# EasyEDA Pro project Project.epro

# Schematic Schematic1
Board Name: Board1; Create Date: 2026-03-28; Page Name: P1; Project Name: usb_hub; Schematic Name: Schematic1; Update Date: 2026-04-05; Company: EasyEDA.com; Page Size: A4; Version: V1.0
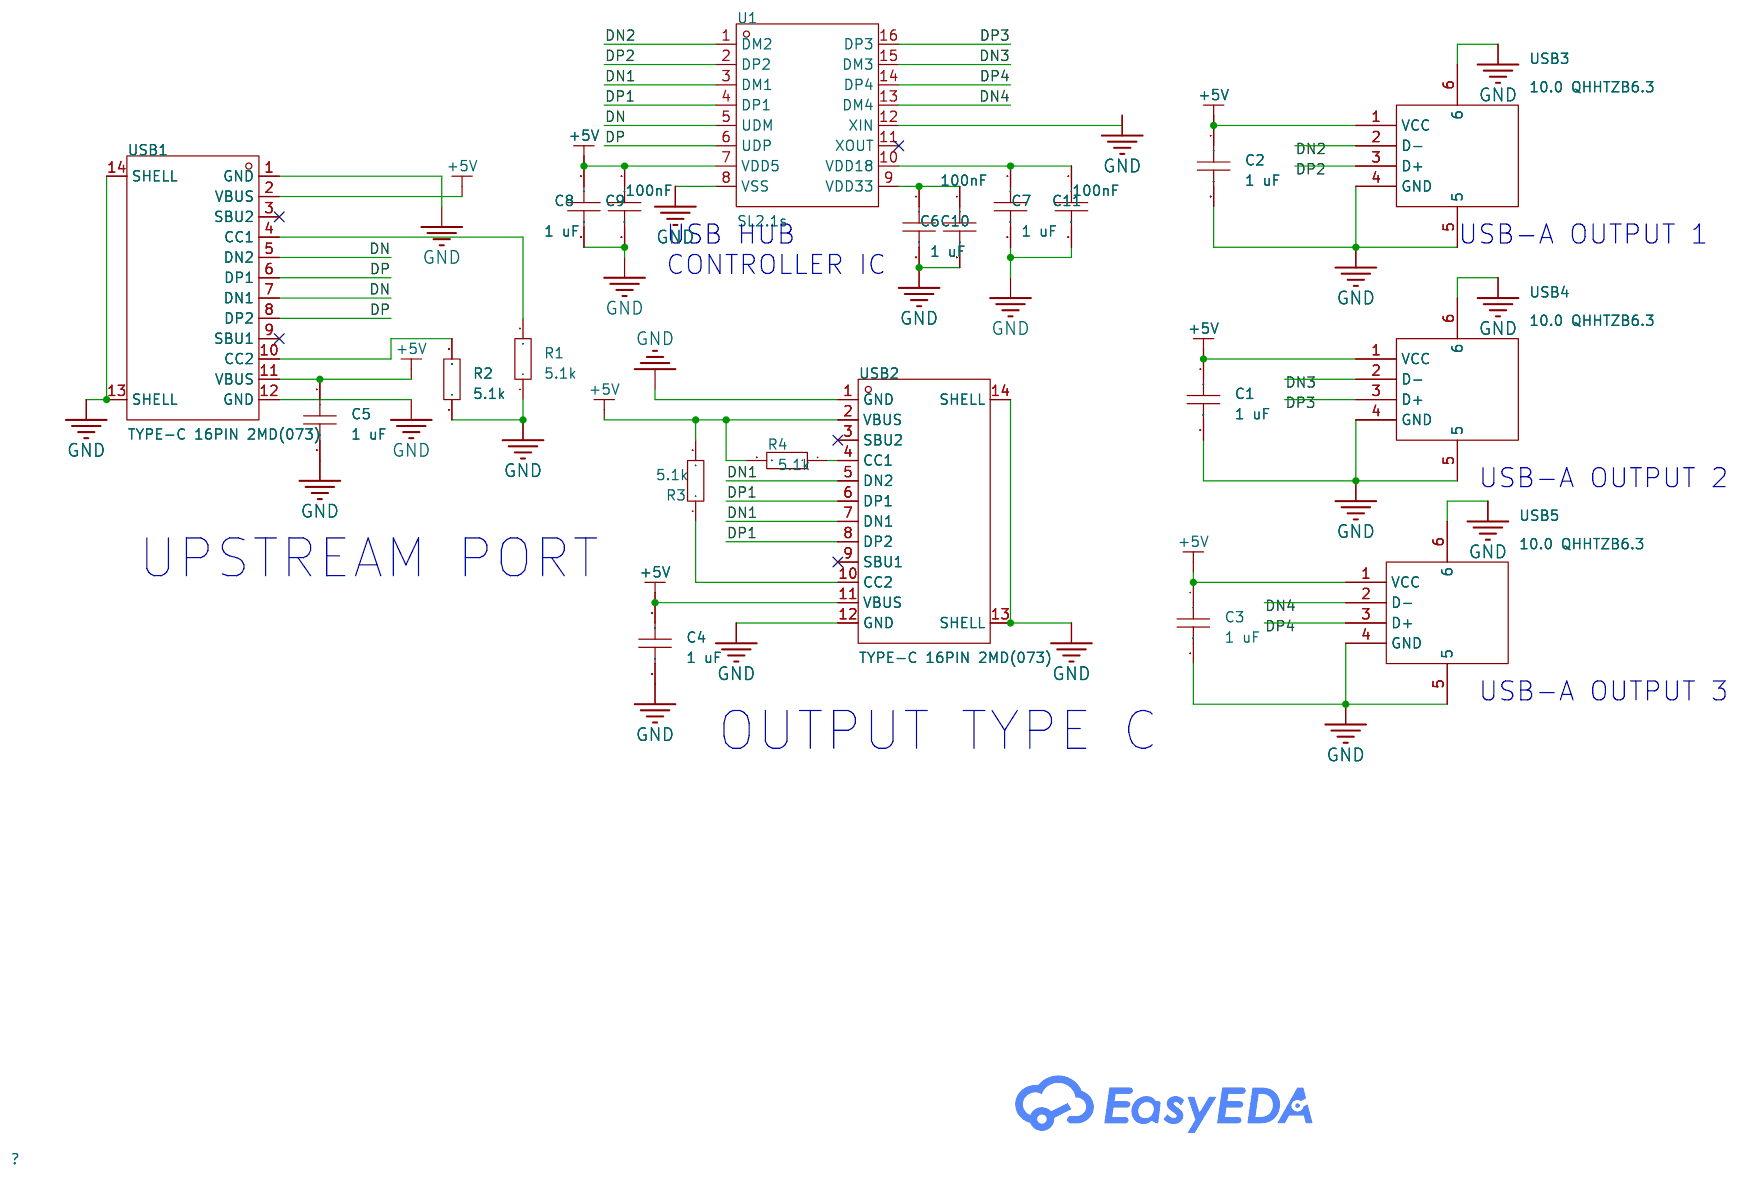
[diagram p0: schematic sheet]

## Parts
C1  1 uF  [C0603]
C2  1 uF  [C0603]
C3  1 uF  [C0603]
C4  1 uF  [C0603]
C5  1 uF  [C0603]
C6  1 uF  [C0603]
C7  1 uF  [C0603]
C8  1 uF  [C0603]
C9  100nF  [C0603]
C10  100nF  [C0603]
C11  100nF  [C0603]
R1  5.1k  [R0603]
R2  5.1k  [R0603]
R3  5.1k  [R0603]
R4  5.1k  [R0603]
U1  SL2.1s  [SSOP-16_L4.6-W2.6-P0.53-LS4.0-BL]
USB1  TYPE-C 16PIN 2MD(073)  [USB-C-SMD_TYPE-C-6PIN-2MD-073]
USB2  TYPE-C 16PIN 2MD(073)  [USB-C-SMD_TYPE-C-6PIN-2MD-073]
USB3  10.0 QHHTZB6.3  [USB-A-TH_10.0QHHTZB6.3]
USB4  10.0 QHHTZB6.3  [USB-A-TH_10.0QHHTZB6.3]
USB5  10.0 QHHTZB6.3  [USB-A-TH_10.0QHHTZB6.3]

## Library data of the parts
C1-C11 = CAP_0603: Supplier Footprint: 0603
R1-R4 = Res_0603: Supplier Footprint: 0603
U1 = SL2.1s: type:Hub USB Protocol:USB 2.0 Voltage - Supply:4V~5.25V Voltage - Supply:4V~5.25V Operating Temperature:0℃~+70℃ Operating Temperature:0℃~+70℃ Current - Supply:120mA Quiescent Supply Current:2.5mA Number of Channels:4; LCSC Part Name: USB2.0 HUB控制器集成电路; Supplier Part: C2684433; Manufacturer: CoreChips(和芯润德); Supplier Footprint: SSOP-16; JLCPCB Part Class: Extended Part; Datasheet: https://item.szlcsc.com/datasheet/SL2.1s/2782346.html; Supplier: LCSC; type: Hub; USB Protocol: USB 2.0; Voltage - Supply: 4V~5.25V; Operating Temperature: 0℃~+70℃; Current - Supply: 120mA; Quiescent Supply Current: 2.5mA; Number of Channels: 4
USB1 USB2 = TYPE-C 16PIN 2MD(073): Connector Type:Type-C Protocol Standard:- Gender:Female Mounting Type:Surface Mount, Right Angle Number of Contacts:16P Number of Ports:1 Current Rating-Power:3A Voltage Rating:5V Connect-Disconnect Life:10,000 Cycles Supplementary Features:- Center Heigh; LCSC Part Name: Type-C 母 卧贴; Supplier Part: C2765186; Manufacturer: SHOU HAN(首韩); Supplier Footprint: SMD; JLCPCB Part Class: Extended Part; Datasheet: https://item.szlcsc.com/datasheet/TYPE-C%252016PIN%25202MD(073)/2901843.html; Supplier: LCSC; Connector Type: Type-C; Gender: Female; Mounting Type: Surface Mount, Right Angle; Number of Contacts: 16P; Number of Ports: 1; Current Rating-Power: 3A; Voltage Rating: 5V; Connect-Disconnect Life: 10,000 Cycles; Detection color: Black; Operating Temperature: -25℃~+85℃
USB3-USB5 = 10.0 QHHTZB6.3: Connector Type:Type-A Protocol Standard:USB 2.0 Gender:Female Mounting Type:Surface Mount, Right Angle Number of Contacts:4P Number of Ports:1 Current Rating-Power:1.5A Voltage Rating:30V Connect-Disconnect Life:5,000 times Supplementary Features:- Center; LCSC Part Name: 壳长10.0mm; Supplier Part: C668591; Manufacturer: SHOU HAN(首韩); Supplier Footprint: SMD; JLCPCB Part Class: Extended Part; Datasheet: https://item.szlcsc.com/datasheet/10.0%2520QHHTZB6.3/698534.html; Supplier: LCSC; Connector Type: Type-A; Protocol Standard: USB 2.0; Gender: Female; Mounting Type: Surface Mount, Right Angle; Number of Contacts: 4P; Number of Ports: 1; Current Rating-Power: 1.5A; Voltage Rating: 30V; Connect-Disconnect Life: 5,000 times; Length: 10mm; Detection color: Black; Operating Temperature: -25℃~+85℃

## Nets
+5V: C1.1 C2.1 C3.1 C4.1 C5.1 C8.1 C9.1 R3.2 R4.2 U1.7(VDD5) USB1.2(VBUS) USB1.11(VBUS) USB2.2(VBUS) USB2.11(VBUS) USB3.1(VCC) USB4.1(VCC) USB5.1(VCC)
GND: C1.2 C2.2 C3.2 C4.2 C5.2 C6.2 C7.2 C8.2 C9.2 C10.2 C11.2 R1.1 R2.1 U1.8(VSS) U1.12(XIN) USB1.1(GND) USB1.12(GND) USB1.13(SHELL) USB1.14(SHELL) USB2.1(GND) USB2.12(GND) USB2.13(SHELL) USB2.14(SHELL) USB3.4(GND) USB3.5 USB3.6 USB4.4(GND) USB4.5 USB4.6 USB5.4(GND) USB5.5 USB5.6
DN: U1.5(UDM) USB1.5(DN2) USB1.7(DN1)
DN1: U1.3(DM1) USB2.5(DN2) USB2.7(DN1)
DN2: U1.1(DM2) USB3.2(D-)
DN3: U1.15(DM3) USB4.2(D-)
DN4: U1.13(DM4) USB5.2(D-)
DP: U1.6(UDP) USB1.6(DP1) USB1.8(DP2)
DP1: U1.4(DP1) USB2.6(DP1) USB2.8(DP2)
DP2: U1.2(DP2) USB3.3(D+)
DP3: U1.16(DP3) USB4.3(D+)
DP4: U1.14(DP4) USB5.3(D+)
$1N843: R2.2 USB1.10(CC2)
$1N849: R1.2 USB1.4(CC1)
$1N1535: R3.1 USB2.10(CC2)
$1N1585: R4.1 USB2.4(CC1)
$1N1869: C6.1 C10.1 U1.9(VDD33)
$1N1897: C7.1 C11.1 U1.10(VDD18)

Not connected (* = marked no-connect by the designer): U1 11(XOUT)*; USB1 3(SBU2)* 9(SBU1)*; USB2 3(SBU2)* 9(SBU1)*

## Notes on the sheet
- USB-A OUTPUT 1
- USB HUB
  CONTROLLER IC
- USB-A OUTPUT 2
- UPSTREAM PORT
- USB-A OUTPUT 3
- OUTPUT TYPE C

# Board PCB1
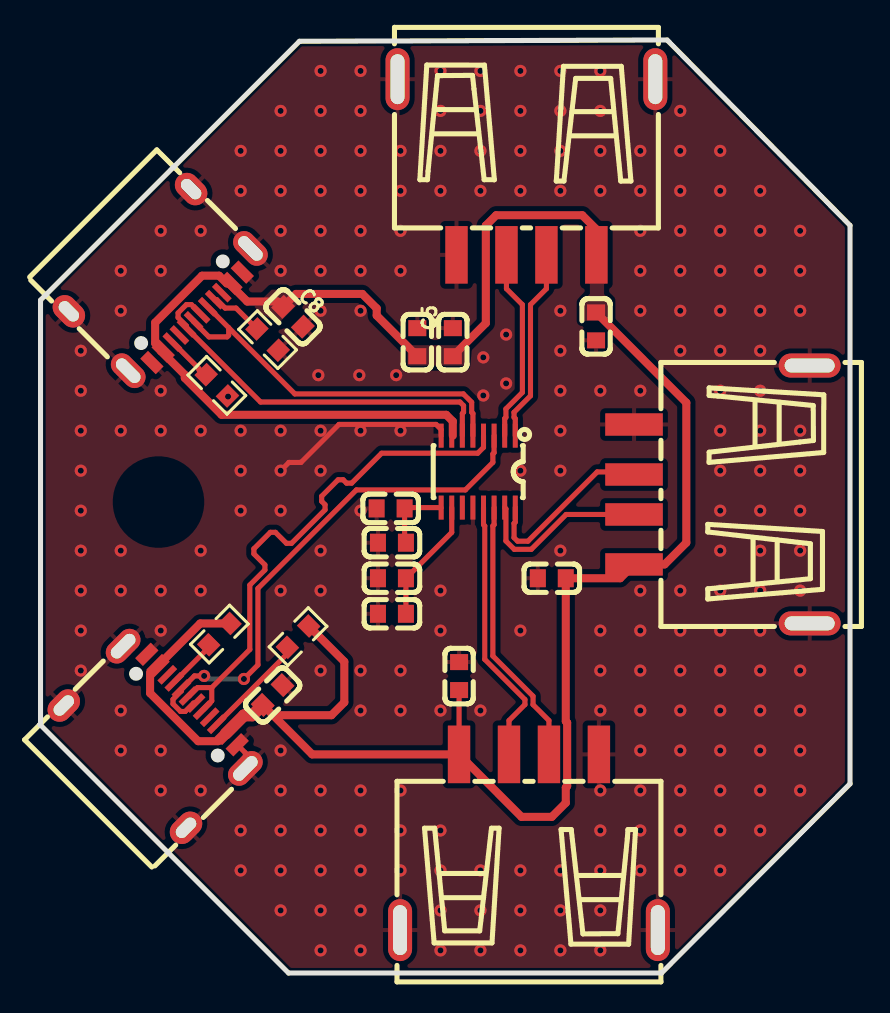
[diagram p1: board, top side]
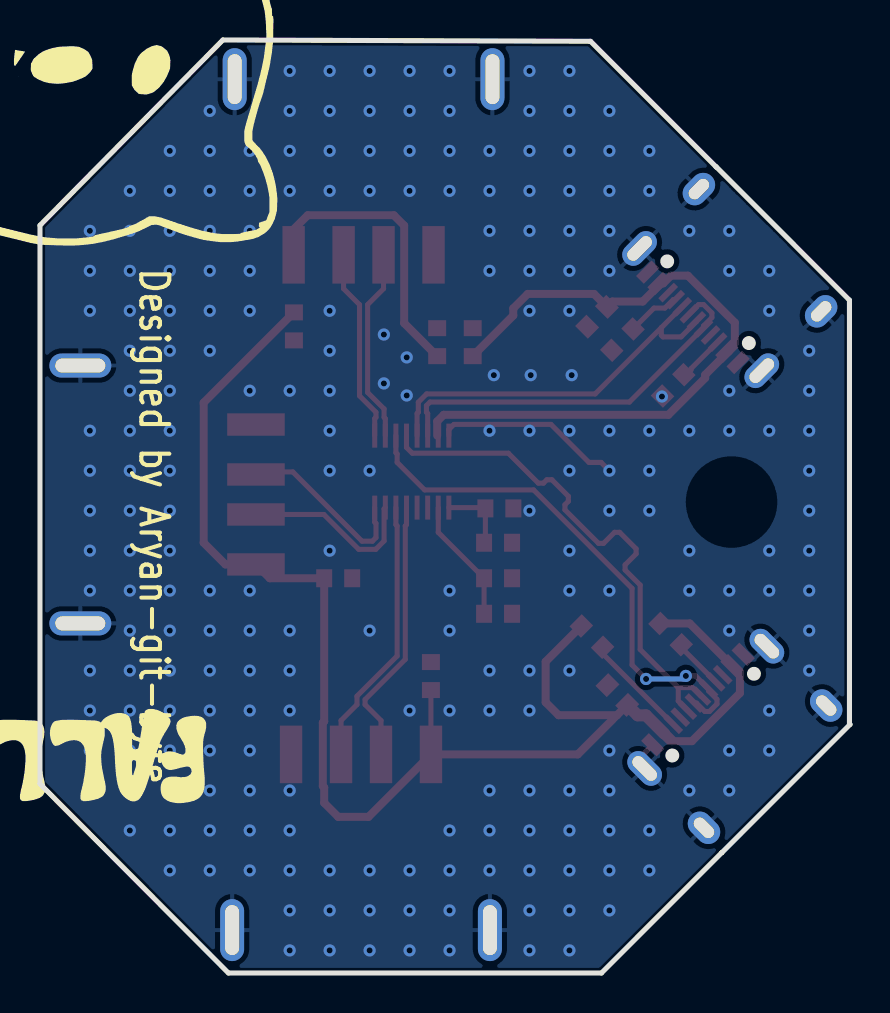
[diagram p2: board, bottom side, seen from below]

Outline 40.54 x 46.68 mm; copper layers: Top Layer, Bottom Layer. Coordinates in mm from the lower left corner of the outline.
Outline path: 0,12.44 6.41,6.02 6.42,6.02 12.44,0 31.11,0 40.54,9.46 40.54,37.4 31.38,46.68 12.99,46.61 6.7,40.33 6.69,40.33 0.03,33.66 0.03,12.47 0,12.44
Stack: Top Layer 0.035mm / Dielectric1 1.51mm FR4 er 4.5 / Bottom Layer 0.035mm

## Design rules (mm)
net DP2: DP5
net DN2: DP5
net DP1: DP2
net DN1: DP2
net DP: DP3
net DN: DP3
net DN4: DP1
net DP4: DP1
net DN3: DP4
net DP3: DP4
template: JLCPCB Capability(Two Layers Board)
spacing copperThickness1oz (default): track to track 0.102, other pairs 0.152 to 0.3
spacing copperThickness2oz: track to track 0.203, other pairs 0.152 to 0.3
track width copperThickness1oz (default): min 0.127, default 0.254, max 2.54
track width copperThickness2oz: min 0.203, default 0.254, max 2.54
differential pair differentialPair (default): width min 0.127, default 0.254, max 2.54; gap min 0.152, default 0.152
via viaSize (default): diameter min 0.5, default 0.61, max 10; hole min 0.3, default 0.305, max 6.3

## Placement (name value [footprint] x y rotation side)
C1  1 uF  [C0603]  20.97 14.86 90 top
C2  1 uF  [C0603]  27.83 32.35 270 top
C3  1 uF  [C0603]  25.62 19.75 180 top
C4  1 uF  [C0603]  11.65 13.91 45 top
C5  1 uF  [C0603]  18.88 31.56 90 top
C6  1 uF  [C0603]  17.55 23.24 180 top
C7  1 uF  [C0603]  17.61 19.75 180 top
C8  1 uF  [C0603]  12.66 32.83 315 top
C9  100nF  [C0603]  20.66 31.56 90 top
C10  100nF  [C0603]  17.61 21.53 180 top
C11  100nF  [C0603]  17.61 17.97 180 top
R1  5.1k  [R0603]  11.39 31.69 135 top
R2  5.1k  [R0603]  8.85 29.4 135 top
R3  5.1k  [R0603]  12.91 16.83 45 top
R4  5.1k  [R0603]  8.98 16.96 45 top
U1  SL2.1s  [SSOP-16_L4.6-W2.6-P0.53-LS4.0-BL]  21.93 25.08 180 top
USB1  TYPE-C 16PIN 2MD(073)  [USB-C-SMD_TYPE-C-6PIN-2MD-073]  6.18 34.48 225 top
USB2  TYPE-C 16PIN 2MD(073)  [USB-C-SMD_TYPE-C-6PIN-2MD-073]  5.93 12 315 top
USB3  10.0 QHHTZB6.3  [USB-A-TH_10.0QHHTZB6.3]  24.34 40.32 180 top
USB4  10.0 QHHTZB6.3  [USB-A-TH_10.0QHHTZB6.3]  34.12 23.94 90 top
USB5  10.0 QHHTZB6.3  [USB-A-TH_10.0QHHTZB6.3]  24.47 6.54 0 top

## Footprints (pads in the part's own frame, mm; a bottom-side part is the same pattern mirrored in y, then rotated)
C0603
  rect 0.8x0.9 smd: 1(-0.7,0) 2(0.7,0)
R0603
  rect 0.806x0.864 smd: 1(-0.753,0) 2(0.753,0)
SSOP-16_L4.6-W2.6-P0.53-LS4.0-BL
  rect 0.25x1.2 smd: 1(-1.855,-1.8) 2(-1.325,-1.8) 3(-0.795,-1.8) 4(-0.265,-1.8) 5(0.265,-1.8) 6(0.795,-1.8) 7(1.325,-1.8) 8(1.855,-1.8) 9(1.855,1.8) 10(1.325,1.8) 11(0.795,1.8) 12(0.265,1.8) 13(-0.265,1.8) 14(-0.795,1.8) 15(-1.325,1.8) 16(-1.855,1.8)
USB-A-TH_10.0QHHTZB6.3
  rect 1.12x2.88 smd: 1(-3.5,4.395) 2(-1,4.395) 3(1,4.395) 4(3.5,4.395)
  oval 1.2x3.1 hole 0.7x2.5: 5(-6.45,-4.395) 6(6.45,-4.395)
USB-C-SMD_TYPE-C-6PIN-2MD-073
  rect 0.55x1.1 smd: 1(-3.2,2.375) 2(-2.4,2.375) 11(2.4,2.375) 12(3.2,2.375)
  rect 0.3x1.1 smd: 3(-1.75,2.375) 4(-1.25,2.375) 5(-0.75,2.375) 6(-0.25,2.375) 7(0.25,2.375) 8(0.75,2.375) 9(1.25,2.375) 10(1.75,2.375)
  oval 1.1x2 hole 0.6x1.5: 13(-4.325,1.825) 14(4.325,1.825)
  oval 1.2x1.8 hole 0.6x1.2: 13(-4.325,-2.375) 14(4.325,-2.375)

## Nets
As in the schematic.

Pads without a net: U1 11; USB1 3 9; USB2 3 9

## Via types
v1: diameter 0.61, hole 0.305, Top Layer to Bottom Layer, 234 vias

## Routing (per net, layer and track width the routed paths; a pad name or vN(x,y) marks a point on that pad's centre or on a via; arc(x,y) is an arc through that point)
+5V: length 123.3
  Top Layer w0.254: USB5.1 20.97,10.94 C1.1
  Top Layer w0.4: 9.31,11.99 8.92,11.6 7.91,11.6 5.51,14 5.51,15.05 ; R4.2 8.02,17.49 USB2.2 ; 6.06,31.11 6.07,31.11 7.25,29.93 7.25,29.77 9.09,27.93 20.33,27.93 20.66,27.6 20.66,26.88 ; C5.1 16.85,32.89 16.85,33.25 16.13,33.97 12.81,33.97 12.17,33.33 11.9,33.59 10.38,33.59 9.56,34.41 USB1.2 9.35,34.5 8.96,34.89 8.11,34.89 5.77,32.54 5.77,31.51 6.17,31.11 ; C2.1 32.35,28.54 32.35,21.53 31.26,20.44 USB4.1 29.04,19.75 C3.1 26.31,12.59 26.38,12.52 26.38,9.35 26.31,9.28 26.31,8.51 25.62,7.81 24.1,7.81 USB5.1 13.63,10.94 11.67,12.9 ; 11.67,12.9 14.59,12.9 15.23,13.54 15.23,15.58 R3.2 ; 11.67,12.9 11.15,13.41 ; C9.1 22.31,32.51 22.31,37.4 22.83,37.91 27.14,37.91 27.84,37.21 USB3.1
  Top Layer w0.6: 11.15,13.41 10.63,12.89 10.21,12.89 9.31,11.99
GND: length 10.8
  Top Layer w0.254: USB2.14 10.28,11.01 USB2.12 ; U1.8 20.08,27.19 19.82,27.45 14.97,27.45 13.06,25.54 12.46,25.54 v1(12.04,25.13)
  vias: v1(2.04,31.13) v1(2.04,29.13) v1(2.04,27.13) v1(2.04,25.13) v1(2.04,23.13) v1(2.04,21.13) v1(2.04,19.13) v1(2.04,17.13) v1(2.04,15.13) v1(4.04,35.13) v1(4.04,33.13) v1(4.04,27.13) v1(4.04,21.13) v1(4.04,19.13) v1(4.04,13.13) v1(4.04,11.13) v1(6.04,37.13) v1(6.04,35.13) v1(6.04,29.13) v1(6.04,27.13) v1(6.04,19.13) v1(6.04,17.13) v1(6.04,11.13) v1(6.04,9.13) v1(8.04,37.13) v1(8.04,27.13) v1(8.04,21.13) v1(8.04,19.13) v1(8.04,9.13) v1(9.41,28.84) v1(10.04,41.13) v1(10.04,39.13) v1(10.04,27.13) v1(10.04,25.13) v1(10.04,23.13) v1(10.04,7.13) v1(10.04,5.13) v1(12.04,43.13) v1(12.04,41.13) v1(12.04,39.13) v1(12.04,37.13) v1(12.04,35.13) v1(12.04,27.13) v1(12.04,23.13) v1(12.04,19.13) v1(12.04,11.13) v1(12.04,9.13) v1(12.04,7.13) v1(12.04,5.13) v1(12.04,3.13) v1(13.93,29.91) v1(14.04,45.13) v1(14.04,43.13) v1(14.04,41.13) v1(14.04,39.13) v1(14.04,37.13) v1(14.04,35.13) v1(14.04,33.13) v1(14.04,27.13) v1(14.04,25.13) v1(14.04,21.13) v1(14.04,19.13) v1(14.04,15.13) v1(14.04,9.13) v1(14.04,7.13) v1(14.04,5.13) v1(14.04,3.13) v1(14.04,1.13) v1(16.04,45.13) v1(16.04,43.13) v1(16.04,41.13) v1(16.04,39.13) v1(16.04,37.13) v1(16.04,35.13) v1(16.04,33.13) v1(15.98,29.91) v1(16.04,27.13) v1(16.04,23.13) v1(16.04,15.13) v1(16.04,13.13) v1(16.04,9.13) v1(16.04,7.13) v1(16.04,5.13) v1(16.04,3.13) v1(16.04,1.13) v1(17.83,29.91) v1(18.04,41.13) v1(18.04,39.13) v1(18.04,37.13) v1(18.04,35.13) v1(18.04,27.13) v1(18.04,15.13) v1(18.04,13.13) v1(18.04,9.13) v1(18.04,7.13) v1(18.04,5.13) v1(20.04,45.13) v1(20.04,43.13) v1(20.04,41.13) v1(20.04,39.13) v1(20.04,19.13) v1(20.04,17.13) v1(20.04,13.13) v1(20.04,7.13) v1(20.04,5.13) v1(20.04,3.13) v1(20.04,1.13) v1(22.04,45.13) v1(22.04,43.13) v1(22.04,41.13) v1(22.04,39.13) v1(22.04,13.13) v1(22.04,5.13) v1(22.04,3.13) v1(22.04,1.13) v1(22.19,30.8) v1(22.19,28.89) v1(23.33,31.94) v1(23.33,29.5) v1(24.04,45.13) v1(24.04,43.13) v1(24.04,41.13) v1(24.04,39.13) v1(24.04,25.13) v1(24.04,17.13) v1(24.04,5.13) v1(24.04,3.13) v1(24.04,1.13) v1(26.04,45.13) v1(26.04,43.13) v1(26.04,41.13) v1(26.04,39.13) v1(26.04,33.13) v1(26.04,31.13) v1(26.04,29.13) v1(26.04,27.13) v1(26.04,25.13) v1(26.04,21.13) v1(26.04,5.13) v1(26.04,3.13) v1(26.04,1.13) v1(28.04,45.13) v1(28.04,43.13) v1(28.04,41.13) v1(28.04,39.13) v1(28.04,29.13) v1(28.04,17.13) v1(28.04,15.13) v1(28.04,13.13) v1(28.04,9.13) v1(28.04,7.13) v1(28.04,5.13) v1(28.04,3.13) v1(28.04,1.13) v1(30.04,41.13) v1(30.04,39.13) v1(30.04,37.13) v1(30.04,35.13) v1(30.04,33.13) v1(30.04,29.13) v1(30.04,19.13) v1(30.04,17.13) v1(30.04,15.13) v1(30.04,13.13) v1(30.04,11.13) v1(30.04,9.13) v1(30.04,7.13) v1(30.04,5.13) v1(32.04,43.13) v1(32.04,41.13) v1(32.04,39.13) v1(32.04,37.13) v1(32.04,35.13) v1(32.04,33.13) v1(32.04,31.13) v1(32.04,19.13) v1(32.04,17.13) v1(32.04,15.13) v1(32.04,13.13) v1(32.04,11.13) v1(32.04,9.13) v1(32.04,7.13) v1(32.04,5.13) v1(34.04,41.13) v1(34.04,39.13) v1(34.04,37.13) v1(34.04,35.13) v1(34.04,33.13) v1(34.04,31.13) v1(34.04,29.13) v1(34.04,27.13) v1(34.04,25.13) v1(34.04,23.13) v1(34.04,21.13) v1(34.04,19.13) v1(34.04,17.13) v1(34.04,15.13) v1(34.04,13.13) v1(34.04,11.13) v1(34.04,9.13) v1(34.04,7.13) v1(34.04,5.13) v1(36.04,39.13) v1(36.04,37.13) v1(36.04,35.13) v1(36.04,33.13) v1(36.04,31.13) v1(36.04,29.13) v1(36.04,27.13) v1(36.04,25.13) v1(36.04,23.13) v1(36.04,21.13) v1(36.04,19.13) v1(36.04,17.13) v1(36.04,15.13) v1(36.04,13.13) v1(36.04,11.13) v1(36.04,9.13) v1(36.04,7.13) v1(38.04,37.13) v1(38.04,35.13) v1(38.04,33.13) v1(38.04,27.13) v1(38.04,25.13) v1(38.04,23.13) v1(38.04,21.13) v1(38.04,19.13) v1(38.04,15.13) v1(38.04,13.13) v1(38.04,11.13) v1(38.04,9.13)
DN: length 19.4
  Top Layer w0.254: USB1.7 7.69,32.59 8.46,31.82 9.37,31.82 9.44,31.9 9.44,32.28 ; 9.44,32.28 USB1.5 ; 9.44,32.28 12.75,28.97 21.19,28.97 21.61,28.55 21.61,28.05 21.67,27.99 U1.5
DN1: length 26.4
  Top Layer w0.254: 7.79,13.51 7.69,13.51 7.27,13.09 7.03,13.09 6.66,13.46 6.66,13.69 7.08,14.11 USB2.5 7.73,14.86 v1(8.22,14.86) ; U1.3 22.73,26.03 22.66,25.97 22.66,25.55 21.29,24.17 15.84,24.17 10.91,19.24 10.91,15.41 v1(10.21,14.71)
  Bottom Layer w0.254: v1(10.21,14.71) 8.37,14.71 v1(8.22,14.86)
DN2: length 9.7
  Top Layer w0.254: U1.1 23.79,27.74 23.72,27.8 23.72,28.05 24.55,28.88 24.55,33.44 25.34,34.24 USB3.2
DN3: length 9
  Top Layer w0.254: U1.15 23.32,23.22 23.32,21.61 23.74,21.2 24.59,21.2 26.33,22.94 USB4.2
DN4: length 13.5
  Top Layer w0.254: USB5.2 23.47,12.63 24.27,13.43 24.27,13.68 22.26,15.69 22.26,22.37 22.2,22.43 U1.13
DP: length 19.4
  Top Layer w0.254: USB1.6 7.58,33.44 7.33,33.44 6.91,33.02 6.91,32.79 7.33,32.37 USB1.8 11.04,28.57 21.02,28.57 21.2,28.39 21.2,28.05 21.14,27.99 U1.6
DP1: length 26.3
  Top Layer w0.254: 8.6,14.28 8.6,13.61 USB2.8 ; 8.6,14.28 10.5,16.18 10.5,19.41 11.26,20.17 11.26,20.42 10.71,20.97 10.71,21.22 11.53,22.05 11.78,22.05 12.33,21.5 12.59,21.5 14.27,23.18 14.27,23.43 14.1,23.6 14.1,23.85 14.92,24.68 15.17,24.68 15.34,24.51 15.6,24.51 17.1,26.01 21.91,26.01 22.2,26.29 U1.4 ; 8.6,14.28 7.88,14.28 7.46,13.86 USB2.6
DP2: length 9.7
  Top Layer w0.254: USB3.3 23.34,34.24 24.14,33.44 24.14,29.05 23.32,28.22 23.32,27.8 23.26,27.74 U1.2
DP3: length 9.1
  Top Layer w0.254: U1.16 23.79,22.56 23.72,22.5 23.72,21.78 23.9,21.6 24.42,21.6 27.88,25.07 29.6,25.07 USB4.3
DP4: length 13.5
  Top Layer w0.254: USB5.3 25.47,12.63 24.68,13.43 24.68,13.85 22.66,15.86 22.66,22.37 22.73,22.43 U1.14
$1N843: length 2.4
  Top Layer w0.254: 6.63,31.57 7.96,30.23 7.96,30.16 8.19,29.93 R2.2
$1N849: length 2.7
  Top Layer w0.254: USB1.4 8.85,33.69 9.27,33.27 9.81,33.27 R1.2
$1N1535: length 5.3
  Top Layer w0.254: USB2.10 12.38,15.98 R3.1
$1N1585: length 2.6
  Top Layer w0.254: USB2.4 8.45,16.29 R4.1
$1N1869: length 3.6
  Top Layer w0.254: C10.1 18.25,21.59 C6.1 18.29,23.28 U1.9
$1N1897: length 6.3
  Top Layer w0.254: C11.1 C7.1 20.61,22.04 U1.10

## Copper pours and planes (outline as drawn; the poured copper is in the pictures)
+5V on Top Layer: 18.3,31.41 21.37,31.41 21.37,30.39 18.3,30.39
+5V on Top Layer: 10.73,34.19 12.97,34.19 12.97,32.45 10.73,32.45
+5V on Top Layer: 27.12,35.52 28.54,35.52 28.54,32.63 27.12,32.63
GND on Top Layer: 4.28,17.34 5.79,17.34 6.06,17.07 6.06,16.71 5.93,16.58 5.93,15.94 5.68,15.69 5.37,15.69 5.08,15.4 4.66,15.81 4.41,15.81 3.87,16.35 3.8,16.35 3.8,16.86
GND on Top Layer: -6.13,49.85 48.35,49.85 48.35,-3.74 -6.13,-3.74
GND on Bottom Layer: -5.88,48.96 49.24,48.96 49.24,-4.13 -5.88,-4.13

## Text on the board
Bottom Silkscreen Layer: Designed by Aryan-git-byte
